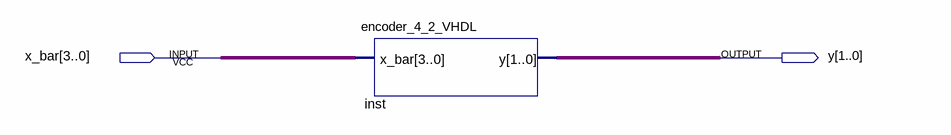
[diagram p0: schematic sheet]
// Quartus schematic encoder_4_2.bdf as structural Verilog: 1 symbols, 2 pins
module encoder_4_2 (
  input  [3:0] x_bar,
  output [1:0] y
);

  encoder_4_2_VHDL inst (.x_bar(x_bar), .y(y));
endmodule
